# EAGLE schematic slider_pot v0.1 (EAGLE 7.4.0)
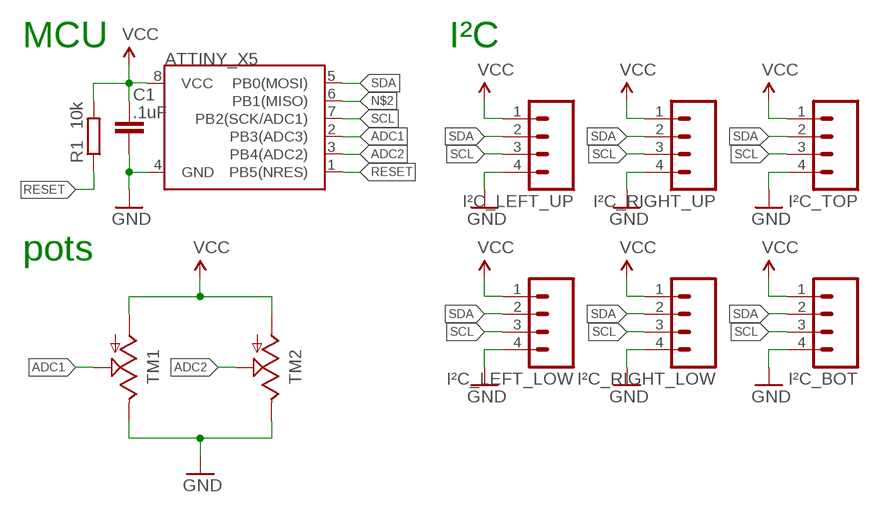
[diagram p0: schematic, sheet 1]

## Parts
ATTINY_X5  ATTINY45TINY45-20-SMT  [SO08-EIAJ]
C1  .1uF  CAPACITOR_NPOL-0805  [C805]
I²C_BOT  M04PTH  [1X04]
I²C_LEFT_LOW  M04PTH  [1X04]
I²C_LEFT_UP  M04PTH  [1X04]
I²C_RIGHT_LOW  M04PTH  [1X04]
I²C_RIGHT_UP  M04PTH  [1X04]
I²C_TOP  M04PTH  [1X04]
R1  10k  RESISTORR805-0805  [R805]
TM1  TRIMSLIDE75  [SLIDEPOT-75]
TM2  TRIMSLIDE75  [SLIDEPOT-75]

## Nets
ADC1: ATTINY_X5.2(PB3(ADC3)) TM1.WIPER
ADC2: ATTINY_X5.3(PB4(ADC2)) TM2.WIPER
GND: ATTINY_X5.4(GND) C1.2 I²C_BOT.4 I²C_LEFT_LOW.4 I²C_LEFT_UP.4 I²C_RIGHT_LOW.4 I²C_RIGHT_UP.4 I²C_TOP.4 TM1.B TM2.B
N$2: ATTINY_X5.6(PB1(MISO))
RESET: ATTINY_X5.1(PB5(NRES)) R1.1
SCL: ATTINY_X5.7(PB2(SCK/ADC1)) I²C_BOT.3 I²C_LEFT_LOW.3 I²C_LEFT_UP.3 I²C_RIGHT_LOW.3 I²C_RIGHT_UP.3 I²C_TOP.3
SDA: ATTINY_X5.5(PB0(MOSI)) I²C_BOT.2 I²C_LEFT_LOW.2 I²C_LEFT_UP.2 I²C_RIGHT_LOW.2 I²C_RIGHT_UP.2 I²C_TOP.2
VCC: ATTINY_X5.8(VCC) C1.1 I²C_BOT.1 I²C_LEFT_LOW.1 I²C_LEFT_UP.1 I²C_RIGHT_LOW.1 I²C_RIGHT_UP.1 I²C_TOP.1 R1.2 TM1.A TM2.A

## Notes on the sheet
- MCU | I²C
- pots

## Library data of the parts
ATTINY_X5 = SparkFun-DigitalIC:ATTINY45: Atmel 8-pin 2/4/8kB flash uC; PROD_ID: IC-08922; VALUE: Tiny45-20-SMT
C1 = dp_devices:CAPACITOR_NPOL: Non-Polarized capacitor in various packages
I²C_BOT I²C_LEFT_LOW I²C_LEFT_UP I²C_RIGHT_LOW I²C_RIGHT_UP I²C_TOP = SparkFun-Connectors:M04: Header 4 Standard 4-pin 0.1" header. Use with straight break away headers (SKU : PRT-00116), right angle break away headers (PRT-00553), swiss pins (PRT-00743), machine pins (PRT-00117), and female headers (PRT-00115). Molex polarized connector foot print use with SKU : PRT-08231 with associated crimp pins and housings. 1MM SMD Version SKU: PRT-10208
R1 = dp_devices:RESISTOR
TM1 TM2 = Bourns PTA series:TRIM: Sliding potentiometers Based on Adafruits (https://github.com/adafruit/Adafruit-Eagle-Library) 'TRIM' device. For Bourns PTA series and TT Electronics PSxx series potentiometers.